# Altium schematic sheet HDD.SchDoc
size A4; SheetNumber: 1; SheetTotal: 1
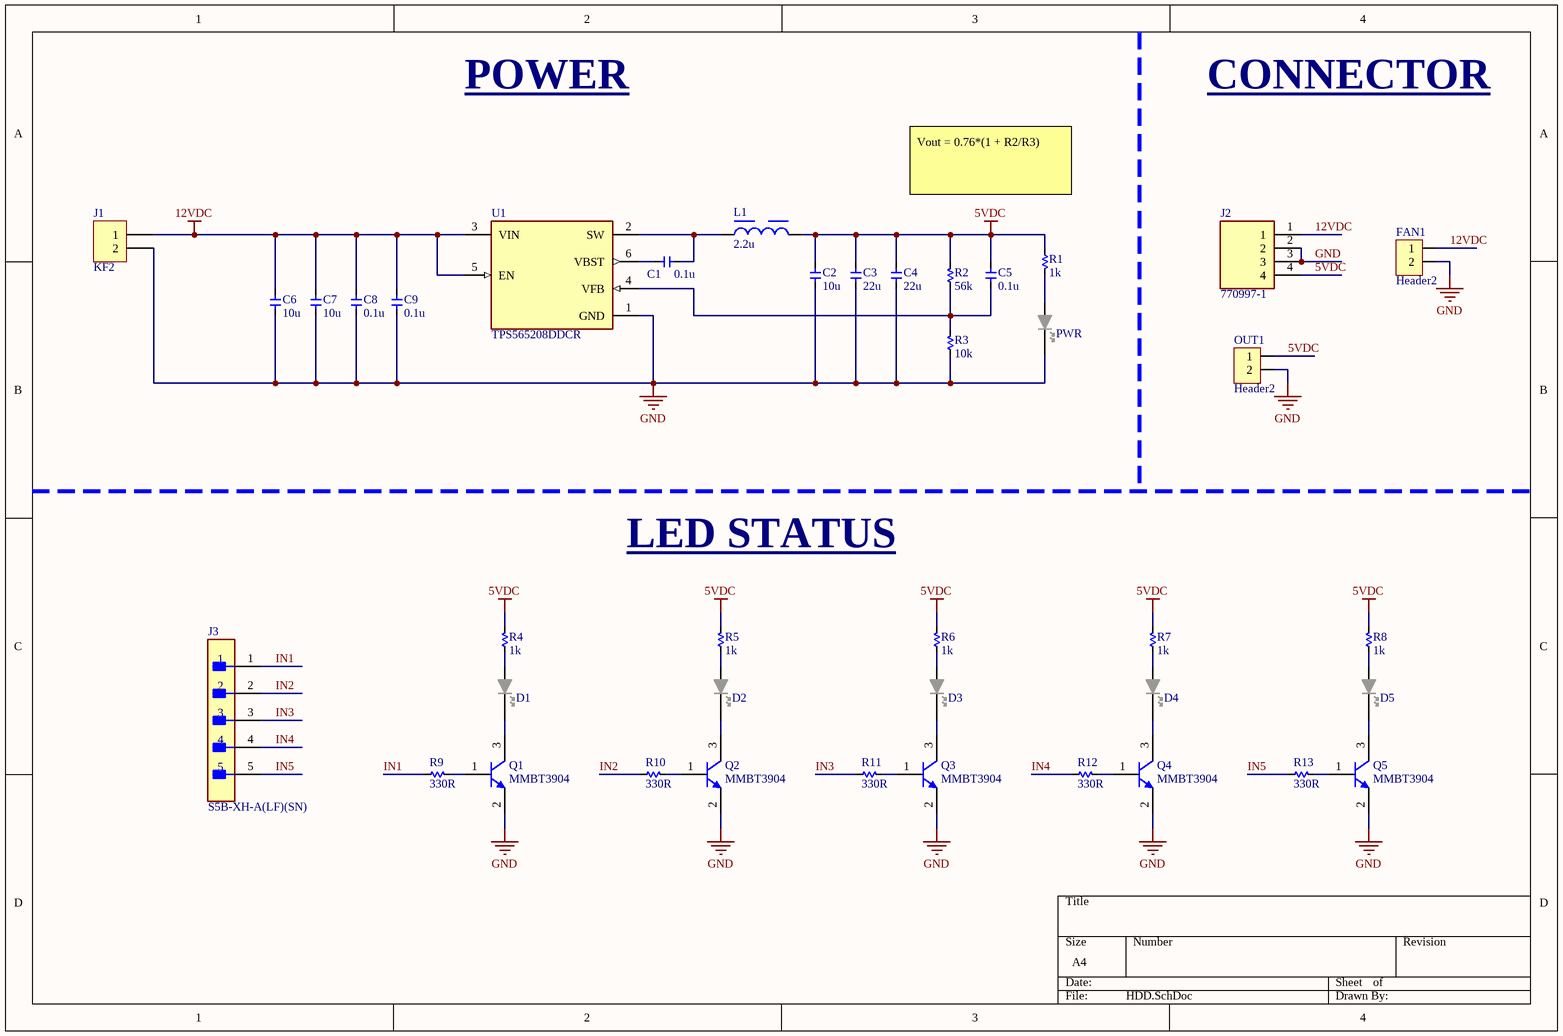
[diagram p0: HDD.SchDoc]

## Parts
C1  0.1u  [CAP-CER-0603]
C2  10u  [CAP-CER-0603]
C3  22u  [CAP-CER-0603]
C4  22u  [CAP-CER-0603]
C5  0.1u  [CAP-CER-0603]
C6  10u  [CAP-CER-0603]
C7  10u  [CAP-CER-0603]
C8  0.1u  [CAP-CER-0603]
C9  0.1u  [CAP-CER-0603]
D1  LED  [SLM-490]  (value not drawn)
D2  LED  [SLM-490]  (value not drawn)
D3  LED  [SLM-490]  (value not drawn)
D4  LED  [SLM-490]  (value not drawn)
D5  LED  [SLM-490]  (value not drawn)
FAN1  Header2  [Header2]
J1  KF2  [KF2-7.62]
J2  770997-1  [RHDR4W158P0X508_1X4_2540X965X1156P]
J3  S5B-XH-A(LF)(SN)  [FP-S5B-XH-A_LF_SN-MFG]
L1  2.2u  [WE-HCI_7040]
OUT1  Header2  [Header2]
PWR  LED  [SLM-490]  (value not drawn)
Q1  MMBT3904  [FAIR-SOT23-3_V]
Q2  MMBT3904  [FAIR-SOT23-3_V]
Q3  MMBT3904  [FAIR-SOT23-3_V]
Q4  MMBT3904  [FAIR-SOT23-3_V]
Q5  MMBT3904  [FAIR-SOT23-3_V]
R1  1k  [RES-SMD-0603]
R2  56k  [RES-SMD-0603]
R3  10k  [RES-SMD-0603]
R4  1k  [RES-SMD-0603]
R5  1k  [RES-SMD-0603]
R6  1k  [RES-SMD-0603]
R7  1k  [RES-SMD-0603]
R8  1k  [RES-SMD-0603]
R9  330R  [RES-SMD-0603]
R10  330R  [RES-SMD-0603]
R11  330R  [RES-SMD-0603]
R12  330R  [RES-SMD-0603]
R13  330R  [RES-SMD-0603]
U1  TPS565208DDCR  [FP-DDC0006A-IPC_A]

## Nets
5VDC: C2.2 C3.2 C4.2 C5.2 J2.4 L1.2 OUT1.1 R1.1 R2.2 R4.2 R5.2 R6.2 R7.2 R8.2
12VDC: C6.2 C7.2 C8.2 C9.2 FAN1.1 J1.1 J2.1 U1.3(VIN) U1.5(EN)
GND: C2.1 C3.1 C4.1 C6.1 C7.1 C8.1 C9.1 FAN1.2 J1.2 J2.2 J2.3 OUT1.2 PWR.K Q1.2(E) Q2.2(E) Q3.2(E) Q4.2(E) Q5.2(E) R3.1 U1.1(GND)
IN1: J3.1 R9.1
IN2: J3.2 R10.1
IN3: J3.3 R11.1
IN4: J3.4 R12.1
IN5: J3.5 R13.1
NetC1_1: C1.1 L1.1 U1.2(SW)
NetC1_2: C1.2 U1.6(VBST)
NetC5_1: C5.1 R2.1 R3.2 U1.4(VFB)
NetD1_A: D1.A R4.1
NetD1_K: D1.K Q1.3(C)
NetD2_A: D2.A R5.1
NetD2_K: D2.K Q2.3(C)
NetD3_A: D3.A R6.1
NetD3_K: D3.K Q3.3(C)
NetD4_A: D4.A R7.1
NetD4_K: D4.K Q4.3(C)
NetD5_A: D5.A R8.1
NetD5_K: D5.K Q5.3(C)
NetPWR_A: PWR.A R1.2
NetQ1_1: Q1.1(B) R9.2
NetQ2_1: Q2.1(B) R10.2
NetQ3_1: Q3.1(B) R11.2
NetQ4_1: Q4.1(B) R12.2
NetQ5_1: Q5.1(B) R13.2

## Notes on the sheet
- POWER
- CONNECTOR
- Vout = 0.76*(1 + R2/R3)
- LED STATUS

## Library data of the parts
C1-C9 = Non-Polar Cap
D1-D5 PWR = LED_5MM_HOLDER_16MM1: 5mm LED Holder Height 16.1mm (w/o LED); Manufacturer: BIVAR; Manufacturer Part Number: SLM-490
FAN1 OUT1 = Header2: Header IDC, 2 x 1 Pin Vertical 2.54mm Pitch (Non-Boxed, Male); Manufacturer: W¨¹rth Elektronik eiSos GmbH; partNo: 613002143121; ComponentLink1 Description: Manufacturer; ComponentLink2 Description: Datasheet; NoPins: 02; Created Date: 29 March 2013; ComponentLink1URL: http://www.we-online.com; ComponentLink2URL: http://katalog.we-online.de/em/datasheet/6130xx143121.pdf; Created by: Karrer Zheng
J1 = KF2: Manufacturer: Würth Elektronik eiSos GmbH; partNo: 691103110002; ComponentLink1 Description: Manufacturer; ComponentLink2 Description: Datasheet; NoPins: 2; Created Date: 29 October 2013; ComponentLink1URL: http://www.we-online.com; ComponentLink2URL: http://katalog.we-online.de/em/datasheet/6911031100xx.pdf; Created by: Karrer Zheng
J2 = 770997-1: Connector; Manufacturer_Name: TE Connectivity; Datasheet Link: https://www.te.com/commerce/DocumentDelivery/DDEController?Action=srchrtrv&DocNm=82181_SOFTSHELL_STANDARD_DENSITY&DocType=Catalog%20Section&DocLang=English&PartCntxt=770997-1&DocFormat=pdf; Height: 11.56mm; Manufacturer_Part_Number: 770997-1; Mouser Part Number: 571-7709971; Mouser Price/Stock: https://www.mouser.co.uk/ProductDetail/TE-Connectivity/770997-1?qs=qXO2HHLAcoJUuzWkn0Acdg%3D%3D; Arrow Part Number: 770997-1; Arrow Price/Stock: https://www.arrow.com/en/products/770997-1/te-connectivity?region=europe
J3 = CMP-17439-000302-1: CONN HEADER R/A 5POS 2.5MM; Contact Resistance: 10mR; Voltage Rating: 250V; Number of Contacts: 5; Current Rating: 3A; Insulation Resistance: 1GR; Wire/Cable Gauge: 22AWG; Number of Rows: 1; Contact Plating: Tin; Fastening Type: Detent; Contact Finish - Mating: TIN; Contact Material: Brass; Lead Free: Lead Free; Connector Type: Header; REACH SVHC: No SVHC; Insulation Color: Natural; Orientation: Right Angle; Contact Type: Male Pin; Pitch: 2.5mm; Contact Shape: Square; Series: XH; Color: Natural; Lead Pitch: 2.5mm; Mount: Through Hole; Termination: Solder; Max Operating Temperature: 85°C; Number of Positions: 5; Flammability Rating: UL94 V-0; Min Operating Temperature: -25°C; Packaging: Bulk; Voltage Rating (AC): 250V; Insulation Material: Nylon
L1 = CMP-0226-00075-3: NexarPartId: 7864287; Saturation Current: 13A; Series Resistance: 12.54mΩ; DC Resistance (DCR): 11.4mΩ; Shielding: Shielded; Test Frequency: 100kHz; RMS Current (Irms): 9A; Inductance Tolerance: 20%; Inductance: 2.2µH; Self Resonant Frequency: 52MHz; Length: 7mm; Case/Package: 7040; Min Operating Temperature: -40°C; Number of Pins: 2; Ambient Temperature Range High: 100°C; Resistance: 11.4mΩ; Composition: Wirewound; Height: 3.8mm; Mount: Surface Mount; RoHS: Compliant; Lead Free: Lead Free; Current Rating: 9A; Termination: SMD/SMT; Ambient Temperature Range Low: -40°C; Packaging: Cut Tape (CT); Max DC Current: 9A; REACH SVHC: Unknown; Max Operating Temperature: 150°C; Tolerance: 20%; Depth: 6.9mm; Width: 6.9mm; Height - Seated (Max): 3.9878mm
Q1-Q5 = CMP-1670-00008-1: NPN General Purpose Amplifier, 40 V, 0.2 A, -55 to 150 degC, 3-Pin SOT23, RoHS, Tape and Reel; Tolerance: 30ppm; Capacitance: 1.8E-11 f; Frequency: 12.288 MHz; ESR: 40 Ohm; Load Capacitance: 18 pF; REACH SVHC: No SVHC; Pins: 4; ComponentLink3URL: http://www.fairchildsemi.com/dwg/MA/MA03D.pdf; PackageDescription: 3-Pin Small Outline Transistor, Body 2.92 x 1.325 mm, Pitch 0.95 mm; ComponentLink1URL: https://www.fairchildsemi.com/; Max Operating Temperature: 70degC; PackageReference: SOT23-3; ComponentLink1Description: Manufacturer URL; Width: 0.126 inch; Min Operating Temperature: -20degC; DatasheetVersion: Rev. 1.1.0, 10/2014; Mount: Surface Mount; Height: 0.041 inch; Package Quantity: 1000; Frequency Tolerance: 30ppm; Packaging: Tape and Reel; ComponentLink2URL: https://www.fairchildsemi.com/datasheets/MM/MMBT3904.pdf; RoHSCompliant: True; ComponentLink3Description: Package Specification; ComponentLink2Description: Datasheet; Length: 0.197 inch
R1-R13 = Res
U1 = CMP-04918-000154-1: IC REG BUCK ADJ 5A TSOT23-6; Min Input Voltage: 4.5V; Min Output Voltage: 760mV; Output Configuration: Positive; Max Output Voltage: 7V; Number of Outputs: 1; Synchronous Rectifier: Yes; Switching Frequency: 500kHz; Max Input Voltage: 17V; Output Type: Adjustable; Mount: Surface Mount; Number of Pins: 6; Case/Package: SOT-23-6; Min Operating Temperature: -40°C; Output Current: 5A; Packaging: Tape and Reel; Max Operating Temperature: 125°C